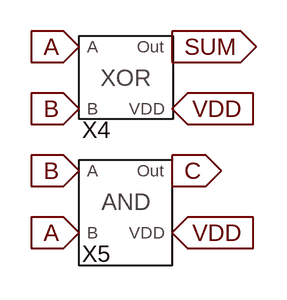
[diagram p0: schematic Half_Adder.asc]
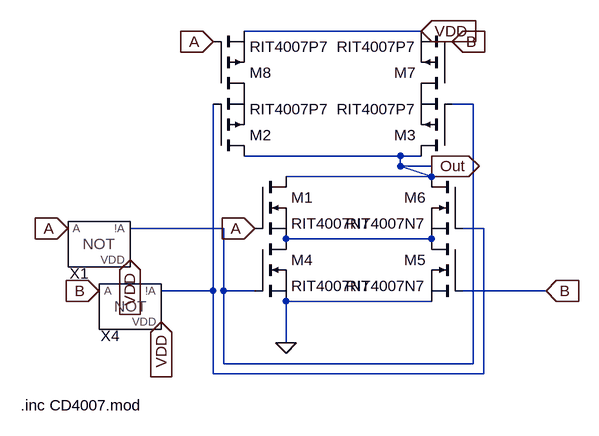
[diagram p1: sub-circuit gate_xor.asc]
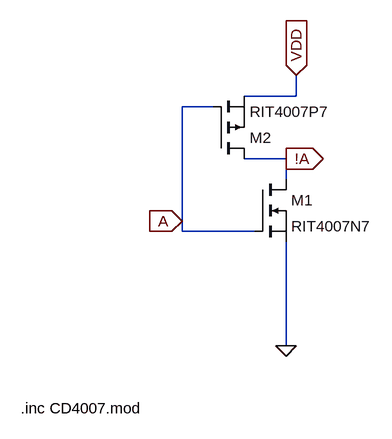
[diagram p2: sub-circuit gate_not.asc]
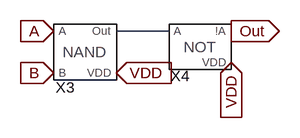
[diagram p3: sub-circuit gate_and.asc]
Half_Adder.asc, the LTspice schematic file:
Version 4
SHEET 1 880 680
FLAG -160 -48 A
IOPIN -160 -48 In
FLAG -160 16 B
IOPIN -160 16 In
FLAG -160 80 B
IOPIN -160 80 In
FLAG -160 144 A
IOPIN -160 144 In
FLAG -64 -48 SUM
IOPIN -64 -48 Out
FLAG -64 80 C
IOPIN -64 80 Out
FLAG -64 16 VDD
IOPIN -64 16 In
FLAG -64 144 VDD
IOPIN -64 144 In
SYMBOL Gate_XOR -112 -16 R0
SYMATTR InstName X4
SYMBOL Gate_AND -112 112 R0
SYMATTR InstName X5

gate_xor.asc, the sub-circuit schematic file:
Version 4
SHEET 1 880 680
WIRE 256 -208 -16 -208
WIRE 336 -96 304 -96
WIRE 224 -16 -16 -16
WIRE 256 -16 224 -16
WIRE 224 0 224 -16
WIRE 272 0 224 0
WIRE 272 16 224 0
WIRE 272 16 48 16
WIRE -48 96 -192 96
WIRE 352 96 320 96
WIRE 272 112 48 112
WIRE -64 192 -64 -96
WIRE -64 192 -144 192
WIRE -48 192 -48 96
WIRE 0 192 -48 192
WIRE 448 192 320 192
WIRE 272 208 48 208
WIRE 48 272 48 208
WIRE -48 304 -48 192
WIRE 336 304 336 -96
WIRE 336 304 -48 304
WIRE -64 320 -64 192
WIRE 352 320 352 96
WIRE 352 320 -64 320
FLAG 48 272 0
FLAG 256 -208 VDD
IOPIN 256 -208 In
FLAG -240 192 B
IOPIN -240 192 In
FLAG -288 96 A
IOPIN -288 96 In
FLAG 304 -192 B
IOPIN 304 -192 In
FLAG 0 96 A
IOPIN 0 96 In
FLAG 448 192 B
IOPIN 448 192 In
FLAG -64 -192 A
IOPIN -64 -192 In
FLAG 272 0 Out
IOPIN 272 0 Out
FLAG -192 144 VDD
IOPIN -192 144 In
FLAG -144 240 VDD
IOPIN -144 240 In
SYMBOL nmos 0 16 R0
SYMATTR InstName M1
SYMATTR Value RIT4007N7
SYMBOL pmos -64 -16 M180
SYMATTR InstName M2
SYMATTR Value RIT4007P7
SYMBOL pmos 304 -16 R180
SYMATTR InstName M3
SYMATTR Value RIT4007P7
SYMBOL nmos 0 112 R0
SYMATTR InstName M4
SYMATTR Value RIT4007N7
SYMBOL nmos 320 112 M0
SYMATTR InstName M5
SYMATTR Value RIT4007N7
SYMBOL nmos 320 16 M0
SYMATTR InstName M6
SYMATTR Value RIT4007N7
SYMBOL pmos 304 -112 R180
SYMATTR InstName M7
SYMATTR Value RIT4007P7
SYMBOL pmos -64 -112 M180
SYMATTR InstName M8
SYMATTR Value RIT4007P7
SYMBOL Gate_NOT -240 128 R0
SYMATTR InstName X1
SYMBOL Gate_NOT -192 224 R0
SYMATTR InstName X4
TEXT -360 368 Left 2 !.inc CD4007.mod

gate_not.asc, the sub-circuit schematic file:
Version 4
SHEET 1 880 680
WIRE 64 -112 64 -144
WIRE 64 -112 -16 -112
WIRE -64 -96 -112 -96
WIRE 48 -16 -16 -16
WIRE 48 16 48 -16
WIRE -112 80 -112 -96
WIRE -112 96 -112 80
WIRE 0 96 -112 96
WIRE 48 272 48 112
FLAG 48 272 0
FLAG -112 80 A
IOPIN -112 80 In
FLAG 48 -16 !A
IOPIN 48 -16 Out
FLAG 64 -144 VDD
IOPIN 64 -144 In
SYMBOL nmos 0 16 R0
SYMATTR InstName M1
SYMATTR Value RIT4007N7
SYMBOL pmos -64 -16 M180
SYMATTR InstName M2
SYMATTR Value RIT4007P7
TEXT -360 368 Left 2 !.inc CD4007.mod

gate_and.asc, the sub-circuit schematic file:
Version 4
SHEET 1 880 680
WIRE -144 0 -224 0
FLAG -224 64 VDD
IOPIN -224 64 In
FLAG -48 48 VDD
IOPIN -48 48 In
FLAG -320 64 B
IOPIN -320 64 In
FLAG -320 0 A
IOPIN -320 0 In
FLAG -48 0 Out
IOPIN -48 0 Out
SYMBOL Gate_NAND -272 32 R0
SYMATTR InstName X3
SYMBOL Gate_NOT -96 32 R0
SYMATTR InstName X4

The netlist it stands for:
* Half_Adder.asc
XX4 A B SUM VDD gate_xor
XX5 B A C VDD gate_and

* block symbol definitions
.subckt gate_xor A B Out VDD
M1 Out A N003 N003 RIT4007N7
M2 Out N002 P001 P001 RIT4007P7
M3 Out N001 P002 P002 RIT4007P7
M4 N003 N001 0 0 RIT4007N7
M5 N003 B 0 0 RIT4007N7
M6 Out N002 N003 N003 RIT4007N7
M7 P002 B VDD VDD RIT4007P7
M8 P001 A VDD VDD RIT4007P7
XX1 A VDD N001 gate_not
XX4 B VDD N002 gate_not
.inc CD4007.mod
.ends gate_xor

.subckt gate_not A VDD !A
M1 !A A 0 0 RIT4007N7
M2 !A A VDD VDD RIT4007P7
.inc CD4007.mod
.ends gate_not

.subckt gate_and A B Out VDD
XX3 A B N001 VDD Gate_NAND  ; pins A B Out VDD
XX4 N001 VDD Out gate_not
.ends gate_and

.model NMOS NMOS
.model PMOS PMOS
.lib standard.mos
.backanno
.end